# Altium schematic sheet USB Phy.SchDoc: USB Phy
size Tabloid; ApprovedBy: NA; CompanyName: Cospan Design LLC; DrawnBy: Dave McCoy; Engineer: Dave McCoy; DocumentNumber: 8; Revision: A; SheetNumber: 8; SheetTotal: 20; Client: Public; Project: Enigma; ProjectPrettyName: Enigma
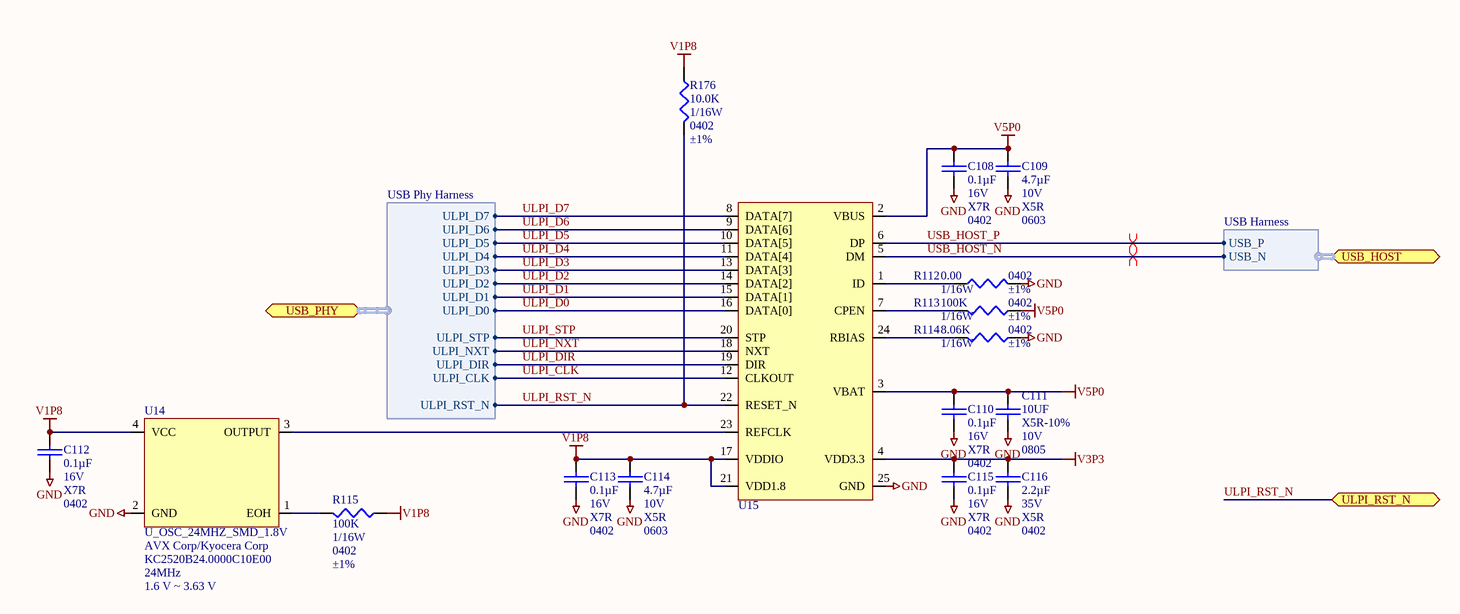
[diagram p0: USB Phy.SchDoc]

## Parts
C108  Capacitance: 0.1µF  Voltage - Rated: 16V  Temperature Coefficient: X7R  Package / Case: 0402  [C_0402]  (hidden comment: 0.1uF)
C109  Voltage - Rated: 10V  Temperature Coefficient: X5R  Package / Case: 0603  [C_ERA-0603]  (hidden comment: 4.7µF)
C110  Capacitance: 0.1µF  Voltage - Rated: 16V  Temperature Coefficient: X7R  Package / Case: 0402  [C_0402]  (hidden comment: 0.1uF)
C111  10UF  TOLERANCE: X5R-10%  VOLTS: 10V  FOOTPRINT: 0805  [C_0805]
C112  Capacitance: 0.1µF  Voltage - Rated: 16V  Temperature Coefficient: X7R  Package / Case: 0402  [C_0402]  (hidden comment: 0.1uF)
C113  Capacitance: 0.1µF  Voltage - Rated: 16V  Temperature Coefficient: X7R  Package / Case: 0402  [C_0402]  (hidden comment: 0.1uF)
C114  Voltage - Rated: 10V  Temperature Coefficient: X5R  Package / Case: 0603  [C_ERA-0603]  (hidden comment: 4.7µF)
C115  Capacitance: 0.1µF  Voltage - Rated: 16V  Temperature Coefficient: X7R  Package / Case: 0402  [C_0402]  (hidden comment: 0.1uF)
C116  Capacitance: 2.2µF  Voltage - Rated: 35V  Temperature Coefficient: X5R  Package / Case: 0402  [C_ERA-0402]  (hidden comment: C_0402_2.2uF_35V)
R112  Resistance In Ohms: 0.00  Power (Watts): 1/16W  Case: 0402  Tolerance: ±1%  [R_0402]  (hidden comment: 0.0 Ohms)
R113  Resistance In Ohms: 100K  Power (Watts): 1/16W  Case: 0402  Tolerance: ±1%  [R_0402]  (hidden comment: R_0402_100K)
R114  Resistance In Ohms: 8.06K  Power (Watts): 1/16W  Case: 0402  Tolerance: ±1%  [R_0402]  (hidden comment: R_0402_8.06K)
R115  Resistance In Ohms: 100K  Power (Watts): 1/16W  Case: 0402  Tolerance: ±1%  [R_0402]  (hidden comment: R_0402_100K)
R176  Resistance In Ohms: 10.0K  Power (Watts): 1/16W  Case: 0402  Tolerance: ±1%  [R_0402]  (hidden comment: R_0402_10.0K)
U14  U_OSC_24MHZ_SMD_1.8V  Manufacturer: AVX Corp/Kyocera Corp  Manufacturer Part Number: KC2520B24.0000C10E00  Frequency: 24MHz  Voltage - Supply: 1.6 V ~ 3.63 V  [OSC_KC5032A]
U15  U_USB3315C  [QFN50P400X400X100_HS-25N]  (value not drawn)

## Ports
ULPI_RST_N, USB_HOST (harness USB Harness), USB_PHY (harness USB Phy Harness)

## Harnesses
USB Phy Harness: ULPI_D7, ULPI_D6, ULPI_D5, ULPI_D4, ULPI_D3, ULPI_D2, ULPI_D1, ULPI_D0, ULPI_STP, ULPI_NXT, ULPI_DIR, ULPI_CLK, ULPI_RST_N
USB Harness: USB_P, USB_N

## Nets
GND: C108.1 C109.1 C110.1 C111.1 C112.1 C113.1 C114.1 C115.1 C116.1 R112.1 R114.2 U14.2(GND) U15.25(GND)
V1P8: C112.2 C113.2 C114.2 R115.2 R176.2 U14.4(VCC) U15.17(VDDIO) U15.21(VDD1.8)
V3P3: C115.2 C116.2 U15.4(VDD3.3)
V5P0: C108.2 C109.2 C110.2 C111.2 R113.2 U15.2(VBUS) U15.3(VBAT)
ULPI_CLK: U15.12(CLKOUT) ; port USB_PHY.ULPI_CLK
ULPI_D0: U15.16(DATA[0]) ; port USB_PHY.ULPI_D0
ULPI_D1: U15.15(DATA[1]) ; port USB_PHY.ULPI_D1
ULPI_D2: U15.14(DATA[2]) ; port USB_PHY.ULPI_D2
ULPI_D3: U15.13(DATA[3]) ; port USB_PHY.ULPI_D3
ULPI_D4: U15.11(DATA[4]) ; port USB_PHY.ULPI_D4
ULPI_D5: U15.10(DATA[5]) ; port USB_PHY.ULPI_D5
ULPI_D6: U15.9(DATA[6]) ; port USB_PHY.ULPI_D6
ULPI_D7: U15.8(DATA[7]) ; port USB_PHY.ULPI_D7
ULPI_DIR: U15.19(DIR) ; port USB_PHY.ULPI_DIR
ULPI_NXT: U15.18(NXT) ; port USB_PHY.ULPI_NXT
ULPI_RST_N: R176.1 U15.22(RESET_N) ; port ULPI_RST_N, port USB_PHY.ULPI_RST_N
ULPI_STP: U15.20(STP) ; port USB_PHY.ULPI_STP
USB_HOST_N: U15.5(DM) ; port USB_HOST.USB_N
USB_HOST_P: U15.6(DP) ; port USB_HOST.USB_P
NetR112_2: R112.2 U15.1(ID)
NetR113_1: R113.1 U15.7(CPEN)
NetR114_1: R114.1 U15.24(RBIAS)
NetR115_1: R115.1 U14.1(EOH)
NetU14_3: U14.3(OUTPUT) U15.23(REFCLK)

## Layout directives
differential pair: USB_HOST_N, USB_HOST_P

## Notes on the sheet
- Project:
- http://www.cospandesign.com
- Cospan Design
- Document:
- Engineer:
- Title:
- Client:
- Approved By:
- Revision:
- Date:
- Number:
- of

## Library data of the parts
C108 C110 C112 C113 C115 = C_0402_0.1UF_16V: CAP CER .10UF 16V X7R 0402; Manufacturer: Murata Electronics North America; Manufacturer Part Number: GRM155R71C104KA88J; Tolerance: ±10%; Description: CAP CER 0.1UF 16V X7R 0402; Supplier 1: Digi-Key; RoHS: RoHS Compliant; Category: Capacitors; Stock 1: 18103134; Pricing 1: 1=0.1, 10=0.014, 100=0.0062, 500=0.00442, 1000=0.00348, 2500=0.00316, 5000=0.00291 (USD); Packaging: Cut Tape (CT); Part Status: Active; Operating Temperature: -55°C ~ 125°C; Features: -; Ratings: -; Applications: General Purpose; Mounting Type: Surface Mount, MLCC; Size / Dimension: 0.039" L x 0.020" W (1.00mm x 0.50mm); Height - Seated (Max): -; Thickness (Max): 0.022" (0.55mm); Lead Spacing: -; ComponentLink1URL: http://www.murata.com/~/media/webrenewal/support/library/catalog/products/capacitor/mlcc/c02e.ashx?la=en-us; ComponentLink1Description: http://www.murata.com/~/media/webrenewal/support/library/catalog/products/capacitor/mlcc/c02e.ashx?la=en-us; Supplier Part Number 1: 490-6328-1-ND
C109 C114 = C_0603_4.7uF_10V: CAP CER 4.7UF 10V X5R 0603; Manufacturer: Murata Electronics North America; Manufacturer Part Number: GRM188R61A475KE15D; Tolerance: ±10%; Supplier 1: Digi-Key; RoHS: RoHS Compliant; Category: Capacitors; Stock 1: 163304; Pricing 1: 1=0.15, 10=0.105, 100=0.0495, 500=0.03472, 1000=0.02875 (USD); Mounting Type: Surface Mount, MLCC; Operating Temperature: -55°C ~ 85°C; Features: Derating Recommended; Applications: General Purpose; Ratings: -; Size / Dimension: 0.063" L x 0.032" W (1.60mm x 0.80mm); Lead Spacing: -; Packaging: Cut Tape (CT); Lead Style: -; ComponentLink1URL: http://search.murata.co.jp/Ceramy/image/img/A01X/G101/ENG/GRM188R61A475KE15-01.pdf; ComponentLink1Description: http://search.murata.co.jp/Ceramy/image/img/A01X/G101/ENG/GRM188R61A475KE15-01.pdf; Supplier Part Number 1: 490-10477-1-ND; Capacitance: 4.7µF; Part Status: Active; Height - Seated (Max): -; Thickness (Max): 0.039" (1.00mm)
C111 = C_0805_10UF_10V: CAP CER 10UF 10V 10% X5R 0805; Manufacturer: Murata Electronics North America; Manufacturer Part Number: GRM21BR61A106KE19L; Capacitance: 10µF; TEMPERATURE: -55/85C; Supplier 1: Digi-Key; Supplier Part Number 1: 490-1709-1-ND; RoHS: RoHS Compliant; Category: Capacitors; Stock 1: 541107; Pricing: 1=0.21, 10=0.144, 50=0.0876, 100=0.0735, 250=0.05952, 500=0.0525, 1000=0.04463 (USD); Packaging: Cut Tape (CT); Voltage - Rated: 10V; Temperature Coefficient: X5R; Mounting Type: Surface Mount, MLCC; Operating Temperature: -55°C ~ 85°C; Applications: General Purpose; Ratings: -; Package / Case: 0805 (2012 Metric); Size / Dimension: 0.079" L x 0.049" W (2.00mm x 1.25mm); Height - Seated (Max): -; Thickness (Max): 0.053" (1.35mm); Lead Spacing: -; Features: -; Lead Style: -; ComponentLink1URL: http://www.murata.com/products/catalog/pdf/c02e.pdf; ComponentLink1Description: http://www.murata.com/products/catalog/pdf/c02e.pdf
C116 = C_0402_2.2uF_35V: CAP CER 2.2UF 35V 20% X5R 0402; Manufacturer: TDK Corporation; Manufacturer Part Number: C1005X5R1V225K050BC; Tolerance: ±10%; Description: CAP CER 2.2UF 35V X5R 0402; Supplier 1: Digi-Key; Supplier Part Number 1: 445-9028-1-ND; RoHS: RoHS Compliant; Category: Capacitors; Stock 1: 300469; Packaging: Cut Tape (CT); Mounting Type: Surface Mount, MLCC; Operating Temperature: -55°C ~ 85°C; Applications: General Purpose; Ratings: -; Size / Dimension: 0.039" L x 0.020" W (1.00mm x 0.50mm); Height - Seated (Max): -; Thickness (Max): 0.022" (0.55mm); Lead Spacing: -; Features: Low ESL; Lead Style: -; ComponentLink1URL: https://product.tdk.com/info/en/catalog/datasheets/mlcc_commercial_general_en.pdf; ComponentLink1Description: https://product.tdk.com/info/en/catalog/datasheets/mlcc_commercial_general_en.pdf; Pricing 1: 1=0.36, 10=0.253, 100=0.1518, 500=0.11386, 1000=0.09614, 2500=0.09108, 5000=0.08602 (USD); Part Status: Active; Failure Rate: -
R112 = R_0402_0.00: RES SMD 0.0OHM JUMPER 1/10W 0402; Manufacturer: Panasonic - ECG; Manufacturer Part Number: ERJ-2GE0R00X; Resistance (Ohms): 0.0; Supplier 1: Digi-Key; Supplier Part Number 1: P0.0JCT-ND; RoHS: RoHS Compliant; Category: Resistors; Stock 1: 9828264; Pricing: 1=0.05, 50=0.0172, 100=0.0131, 250=0.00976, 500=0.0072, 1000=0.0048, 5000=0.00338 (USD); Composition: Thick Film; Features: -; Temperature Coefficient: -; Package / Case: 0402 (1005 Metric); Size / Dimension: 0.039" L x 0.020" W (1.00mm x 0.50mm); Height: 0.016" (0.40mm); Number of Terminations: 2; Packaging: Cut Tape (CT); ComponentLink1URL: http://industrial.panasonic.com/www-cgi/jvcr13pz.cgi?E+PZ+3+AOA0001+ERJ2GE0R00X+7+WW; ComponentLink1Description: http://industrial.panasonic.com/www-cgi/jvcr13pz.cgi?E+PZ+3+AOA0001+ERJ2GE0R00X+7+WW
R113 R115 = R_0402_100K: RES SMD 100K OHM 1% 1/16W 0402; Manufacturer: Yageo; Manufacturer Part Number: RC0402FR-07100KL; Temperature Coefficient: ±100ppm/°C; Supplier 1: Digi-Key; RoHS: RoHS Compliant; Category: Resistors; Stock 1: 4989982; Pricing 1: 1=0.1, 10=0.013, 25=0.0096, 100=0.0054, 250=0.00412, 500=0.00328, 1000=0.00242, 2500=0.0021, 5000=0.00173 (USD); Packaging: Cut Tape (CT); Resistance (Ohms): 100k; Composition: Thick Film; Features: Moisture Resistant; Operating Temperature: -55°C ~ 155°C; Package / Case: 0402 (1005 Metric); Supplier Device Package: 0402; Size / Dimension: 0.039" L x 0.020" W (1.00mm x 0.50mm); Height: 0.016" (0.40mm); Number of Terminations: 2; ComponentLink1URL: http://www.yageo.com/NewPortal/yageodocoutput?fileName=/pdf/R-Chip/PYu-RC_Group_51_RoHS_L_3.pdf; ComponentLink1Description: http://www.yageo.com/NewPortal/yageodocoutput?fileName=/pdf/R-Chip/PYu-RC_Group_51_RoHS_L_3.pdf; Supplier Part Number 1: 311-100KLRCT-ND
R114 = R_0402_8.06K: RES 8.06K OHM 1/16W 1% 0402 SMD; Manufacturer: Yageo; Manufacturer Part Number: RC0402FR-078K06L; Temperature Coefficient: ±100ppm/°C; Supplier 1: Digi-Key; Supplier Part Number 1: 311-8.06KLRCT-ND; RoHS: RoHS Compliant; Category: Resistors; Stock 1: 102694; Pricing: 10=0.014, 50=0.0104, 100=0.0079, 250=0.00584, 500=0.00432, 1000=0.00288 (USD); Resistance (Ohms): 8.06K; Composition: Thick Film; Features: -; Size / Dimension: 0.039" L x 0.020" W (1.00mm x 0.50mm); Height: 0.016" (0.40mm); Number of Terminations: 2; Packaging: Cut Tape (CT); Package / Case: 0402 (1005 Metric); ComponentLink1URL: http://www.yageo.com/documents/recent/PYu-RC0402_51_RoHS_L_6.pdf; ComponentLink1Description: http://www.yageo.com/documents/recent/PYu-RC0402_51_RoHS_L_6.pdf
R176 = R_0402_10.0K: RES 10.0K OHM 1/16W 1% 0402 SMD; Manufacturer: Stackpole Electronics Inc; Manufacturer Part Number: RMCF0402FT10K0; Resistance (Ohms): 10k; Temperature Coefficient: ±100ppm/°C; Supplier 1: Digi-Key; Supplier Part Number 1: RMCF0402FT10K0CT-ND; RoHS: RoHS Compliant; Category: Resistors; Stock 1: 234525; Pricing: 1=0.04, 10=0.025, 50=0.0138, 100=0.0105, 250=0.0078, 500=0.00576, 1000=0.00384, 2500=0.00324, 5000=0.0027 (USD); Composition: Thick Film; Features: -; Package / Case: 0402 (1005 Metric); Size / Dimension: 0.039" L x 0.020" W (1.00mm x 0.50mm); Height: 0.016" (0.40mm); Number of Terminations: 2; Packaging: Cut Tape (CT); ComponentLink1URL: http://www.seielect.com/Catalog/SEI-RMCF_RMCP.pdf; ComponentLink1Description: http://www.seielect.com/Catalog/SEI-RMCF_RMCP.pdf
U14 = U_OSC_24MHZ_SMD_1.8V: 24MHz CMOS XO (Standard) Oscillator; Function: Standby (Power Down); Frequency Stability: ±50ppm; Current - Supply (Max): 5mA; Current - Supply (Disable) (Max): 10µA; Supplier 1: Digi-Key; RoHS: RoHS Compliant; Category: Crystals, Oscillators, Resonators; Stock 1: 6138; Pricing 1: 1=1.41, 10=1.348, 50=1.3168, 100=1.1286, 500=1.09726, 1000=0.92483 (USD); Packaging: Cut Tape (CT); Part Status: Active; Type: XO (Standard); Output: CMOS; Operating Temperature: -10°C ~ 70°C; Ratings: -; Mounting Type: Surface Mount; Package / Case: 4-SMD, No Lead; Size / Dimension: 0.098" L x 0.079" W (2.50mm x 2.00mm); Height - Seated (Max): 0.028" (0.70mm); ComponentLink1URL: http://global.kyocera.com/prdct/electro/product/pdf/kc2520b_c1_e.pdf; ComponentLink1Description: http://global.kyocera.com/prdct/electro/product/pdf/kc2520b_c1_e.pdf; Supplier Part Number 1: 478-4778-1-ND
U15 = U_USB3315C: IC TXRX USB FLEXPWR 24QFN; Manufacturer: Microchip Technology; Manufacturer Part Number: USB3315C-CP-TR; Protocol: USB 2.0; Number of Drivers/Receivers: 1/1; Voltage - Supply: 1.8 V ~ 3.3 V; Supplier 1: Digi-Key; RoHS: RoHS Compliant; Category: Integrated Circuits (ICs); Stock 1: 12400; Pricing 1: 1=1.28, 25=1.0712, 100=0.9682 (USD); Packaging: Cut Tape (CT); Part Status: Active; Type: Transceiver; Duplex: -; Data Rate: -; Operating Temperature: -40°C ~ 85°C; Mounting Type: Surface Mount; Package / Case: 24-VFQFN Exposed Pad; Supplier Device Package: 24-QFN (4x4); ComponentLink1URL: http://www.microchip.com/mymicrochip/filehandler.aspx?ddocname=en562026; ComponentLink1Description: http://www.microchip.com/mymicrochip/filehandler.aspx?ddocname=en562026; Supplier Part Number 1: USB3315C-CP-CT-ND